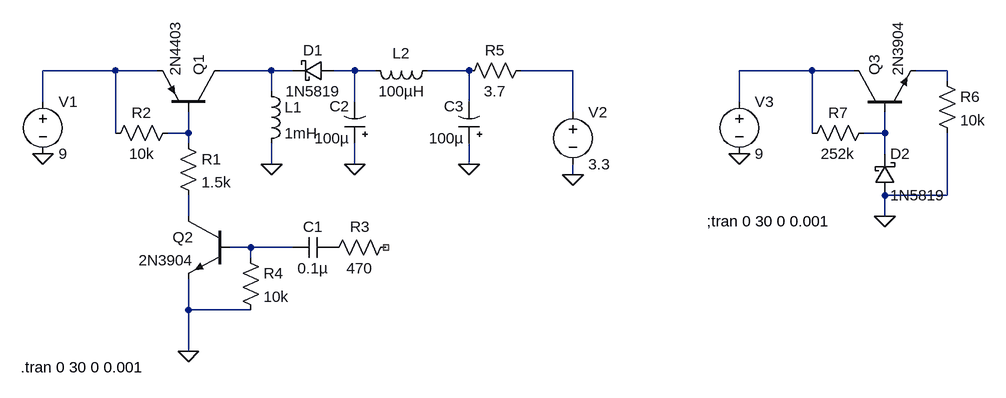
[diagram p0: schematic reg.asc]
reg.asc, the LTspice schematic file:
Version 4
SHEET 1 1408 680
WIRE 48 80 -64 80
WIRE 112 80 48 80
WIRE 288 80 208 80
WIRE 320 80 288 80
WIRE 416 80 384 80
WIRE 448 80 416 80
WIRE 592 80 528 80
WIRE 752 80 672 80
WIRE 1120 80 1008 80
WIRE 1184 80 1120 80
WIRE 1328 80 1280 80
WIRE 1328 96 1328 80
WIRE 288 112 288 80
WIRE -64 128 -64 80
WIRE 416 128 416 80
WIRE 592 128 592 80
WIRE 1008 128 1008 80
WIRE 752 144 752 80
WIRE 48 176 48 80
WIRE 160 176 160 144
WIRE 160 176 128 176
WIRE 1120 176 1120 80
WIRE 1232 176 1232 144
WIRE 1232 176 1200 176
WIRE 160 192 160 176
WIRE 1232 208 1232 176
WIRE 288 224 288 192
WIRE 416 224 416 192
WIRE 592 224 592 192
WIRE 752 240 752 224
WIRE 1328 272 1328 176
WIRE 1328 272 1232 272
WIRE 160 304 160 272
WIRE 1232 304 1232 272
WIRE 256 352 224 352
WIRE 320 352 256 352
WIRE 256 368 256 352
WIRE 160 448 160 400
WIRE 256 448 160 448
WIRE 160 512 160 448
FLAG 288 224 0
FLAG 160 512 0
FLAG -64 208 0
FLAG 416 224 0
FLAG 592 224 0
FLAG 752 240 0
FLAG 1232 304 0
FLAG 1008 208 0
SYMBOL pnp 208 144 M270
SYMATTR InstName Q1
SYMATTR Value 2N4403
SYMBOL res 144 176 R0
SYMATTR InstName R1
SYMATTR Value 1.5k
SYMBOL res 144 160 R90
WINDOW 0 0 56 VBottom 2
WINDOW 3 32 56 VTop 2
SYMATTR InstName R2
SYMATTR Value 10k
SYMBOL npn 224 304 M0
SYMATTR InstName Q2
SYMATTR Value 2N3904
SYMBOL res 240 352 R0
SYMATTR InstName R4
SYMATTR Value 10k
SYMBOL ind 272 96 R0
SYMATTR InstName L1
SYMATTR Value 1mH
SYMBOL cap 384 336 R90
WINDOW 0 0 32 VBottom 2
WINDOW 3 32 32 VTop 2
SYMATTR InstName C1
SYMATTR Value 0.1µ
SYMBOL voltage -64 112 R0
WINDOW 123 0 0 Left 0
WINDOW 39 0 0 Left 0
SYMATTR InstName V1
SYMATTR Value 9
SYMBOL res 480 336 R90
WINDOW 0 0 56 VBottom 2
WINDOW 3 32 56 VTop 2
SYMATTR InstName R3
SYMATTR Value 470
SYMBOL schottky 384 96 M270
WINDOW 0 32 32 VTop 2
WINDOW 3 0 32 VBottom 2
SYMATTR InstName D1
SYMATTR Value 1N5819
SYMATTR Description Diode
SYMATTR Type diode
SYMBOL polcap 432 192 R180
WINDOW 0 24 57 Left 2
WINDOW 3 24 8 Left 2
SYMATTR InstName C2
SYMATTR Value 100µ
SYMBOL ind 544 64 R90
WINDOW 0 5 56 VBottom 2
WINDOW 3 32 56 VTop 2
SYMATTR InstName L2
SYMATTR Value 100µH
SYMBOL polcap 608 192 R180
WINDOW 0 24 57 Left 2
WINDOW 3 24 8 Left 2
SYMATTR InstName C3
SYMATTR Value 100µ
SYMBOL res 688 64 R90
WINDOW 0 0 56 VBottom 2
WINDOW 3 32 56 VTop 2
SYMATTR InstName R5
SYMATTR Value 3.7
SYMBOL voltage 752 128 R0
WINDOW 123 0 0 Left 0
WINDOW 39 0 0 Left 0
SYMATTR InstName V2
SYMATTR Value 3.3
SYMBOL res 1216 160 R90
WINDOW 0 0 56 VBottom 2
WINDOW 3 32 56 VTop 2
SYMATTR InstName R7
SYMATTR Value 252k
SYMBOL voltage 1008 112 R0
WINDOW 123 0 0 Left 0
WINDOW 39 0 0 Left 0
SYMATTR InstName V3
SYMATTR Value 9
SYMBOL schottky 1216 272 M180
WINDOW 0 24 64 Left 2
WINDOW 3 24 0 Left 2
SYMATTR InstName D2
SYMATTR Value 1N5819
SYMATTR Description Diode
SYMATTR Type diode
SYMBOL res 1312 80 R0
SYMATTR InstName R6
SYMATTR Value 10k
SYMBOL npn 1184 144 R270
SYMATTR InstName Q3
SYMATTR Value 2N3904
TEXT -98 536 Left 2 !.tran 0 30 0 0.001
TEXT 958 312 Left 2 !;tran 0 30 0 0.001

The netlist it stands for:
* reg.asc
Q1 N002 N008 N001 0 2N4403
R1 N008 N010 1.5k
R2 N008 N001 10k
Q2 N010 N011 0 0 2N3904
R4 N011 0 10k
L1 N002 0 1mH
C1 P001 N011 0.1µ
V1 N001 0 9
R3 NC_01 P001 470
D1 N003 N002 1N5819
C2 0 N003 100µ
L2 N004 N003 100µH
C3 0 N004 100µ
R5 N005 N004 3.7
V2 N005 0 3.3
R7 N009 N006 252k
V3 N006 0 9
D2 0 N009 1N5819
R6 N007 0 10k
Q3 N006 N009 N007 0 2N3904
.model D D
.lib standard.dio
.model NPN NPN
.model PNP PNP
.lib standard.bjt
.tran 0 30 0 0.001
;tran 0 30 0 0.001
.backanno
.end